# Altium schematic sheet Sheet1.SchDoc
size A; SheetNumber: 1; SheetTotal: 1
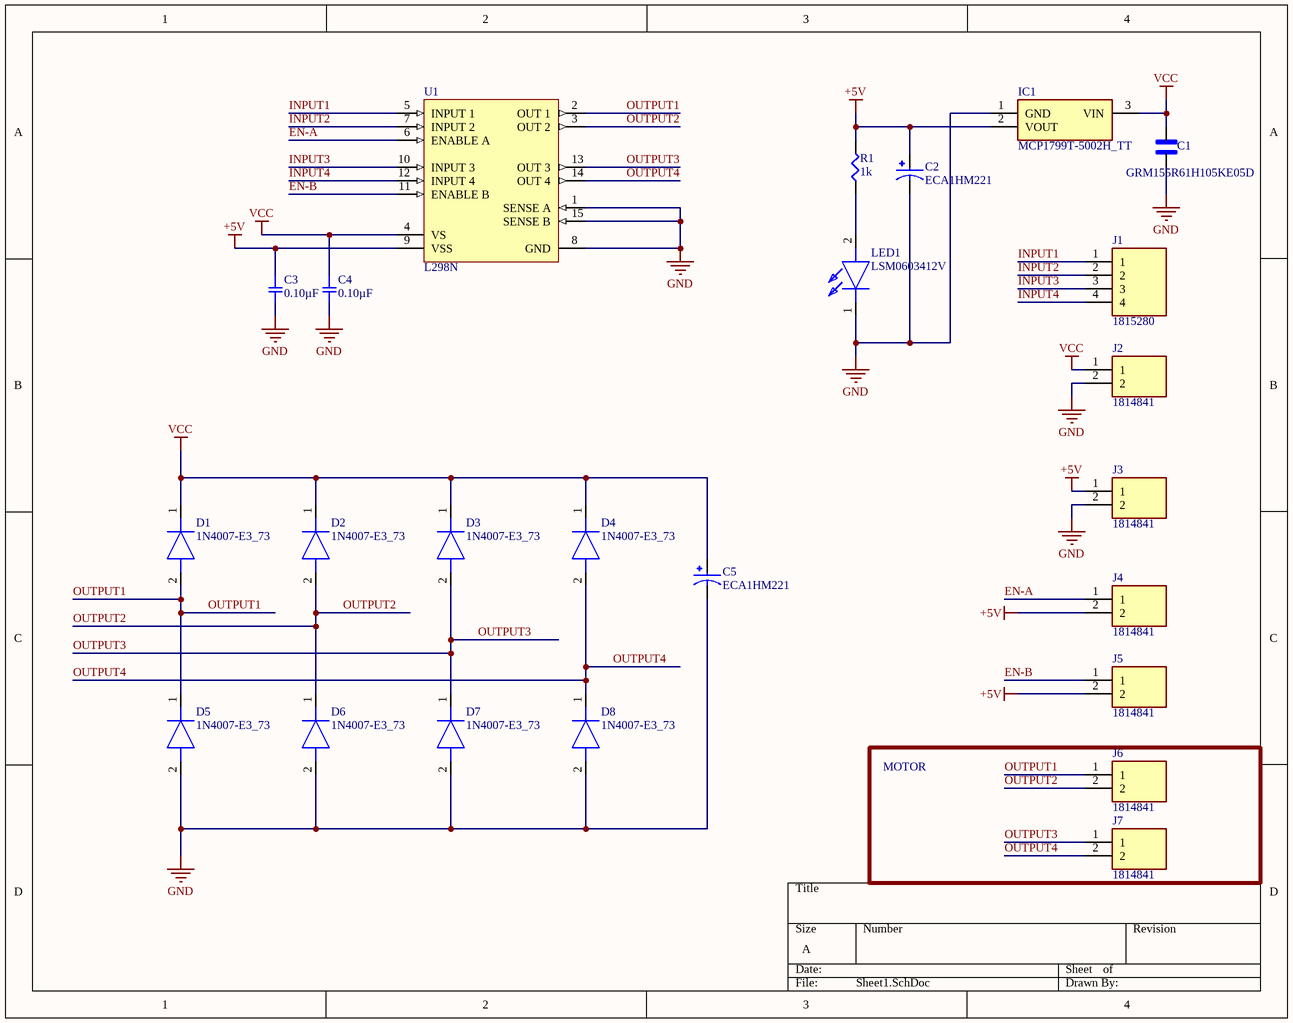
[diagram p0: Sheet1.SchDoc]

## Parts
C1  GRM155R61H105KE05D  [CAPC1005X60N]
C2  ECA1HM221  [CAPPRD500W60D1000H1250]
C3  0.10µF  [SMD-0402C]
C4  0.10µF  [SMD-0402C]
C5  ECA1HM221  [CAPPRD500W60D1000H1250]
D1  1N4007-E3_73  [PCBComponent_1]
D2  1N4007-E3_73  [PCBComponent_1]
D3  1N4007-E3_73  [PCBComponent_1]
D4  1N4007-E3_73  [PCBComponent_1]
D5  1N4007-E3_73  [PCBComponent_1]
D6  1N4007-E3_73  [PCBComponent_1]
D7  1N4007-E3_73  [PCBComponent_1]
D8  1N4007-E3_73  [PCBComponent_1]
IC1  MCP1799T-5002H_TT  [SOT95P237X112-3N]
J1  1815280  [1815280]
J2  1814841  [1814841]
J3  1814841  [1814841]
J4  1814841  [1814841]
J5  1814841  [1814841]
J6  1814841  [1814841]
J7  1814841  [1814841]
LED1  LSM0603412V  [LSM0603412V]
R1  1k  [SMD-0402-RES]
U1  L298N  [STM-FM-15]

## Blocks framed on the sheet
MOTOR: J6 J7

## Nets
+5V: C2.P C3.1 IC1.2(VOUT) J3.1 J4.2 J5.2 R1.2 U1.9(VSS)
GND: C1.1 C2.N C3.2 C4.2 C5.N D5.2(A) D6.2(A) D7.2(A) D8.2(A) IC1.1(GND) J2.2 J3.2 LED1.1(K) U1.1(SENSE_A) U1.8(GND) U1.15(SENSE_B)
VCC: C1.2 C4.1 C5.P D1.1(K) D2.1(K) D3.1(K) D4.1(K) IC1.3(VIN) J2.1 U1.4(VS)
EN-A: J4.1 U1.6(ENABLE_A)
EN-B: J5.1 U1.11(ENABLE_B)
INPUT1: J1.1 U1.5(INPUT_1)
INPUT2: J1.2 U1.7(INPUT_2)
INPUT3: J1.3 U1.10(INPUT_3)
INPUT4: J1.4 U1.12(INPUT_4)
OUTPUT1: D1.2(A) D5.1(K) J6.1 U1.2(OUT_1)
OUTPUT2: D2.2(A) D6.1(K) J6.2 U1.3(OUT_2)
OUTPUT3: D3.2(A) D7.1(K) J7.1 U1.13(OUT_3)
OUTPUT4: D4.2(A) D8.1(K) J7.2 U1.14(OUT_4)
NetLED1_2: LED1.2(A) R1.1

## Library data of the parts
C1 = GRM155R61H105KE05D: Capacitor Ceramic Multilayer (MLCC); MF: {'manufacturer': u'Murata'}; Package: None; Price: None; Value: *; MP: GRM155R61H105KE05D; Availability: Unavailable
C2 C5 = ECA1HM221: M-A; MF: {'manufacturer': u'Panasonic'}; Package: None; Price: None; Value: *; MP: ECA1HM221; Availability: Unavailable
C3 C4 = GRM155R61H104KE14D: CAP CER 0.1UF 50V X5R 0402; Manufacturer: Murata Electronics North America; Factory Stock: 0; Unit Price (USD): 0.1; Minimum Quantity: 1; Tolerance: ±10%; Datasheets: http://www.murata.com/~/media/webrenewal/support/library/catalog/products/capacitor/mlcc/c02e.pdf; Image: //media.digikey.com/Renders/Murata%20Renders/ZRB-SERIES-0402.jpg; Digi-Key Part Number: 490-10697-1-ND; Part Number: GRM155R61H104KE14D; Quantity Available: 329219; @ qty: 0; Packaging: Cut Tape (CT); Series: GRM; Part Status: Active; Value: 0.10µF; Voltage: 50V; Temperature Coefficient: X5R; Operating Temperature: -55°C ~ 85°C; Features: -; Ratings: -; Applications: General Purpose; Mounting Type: Surface Mount, MLCC; Package / Case: 0402 (1005 Metric); Size / Dimension: 0.039" L x 0.020" W (1.00mm x 0.50mm); Height - Seated (Max): -; Thickness (Max): 0.022" (0.55mm); Lead Spacing: -; Lead Style: -
D1-D8 = 1N4007-E3_73: Diode; Manufacturer_Name: Vishay; Manufacturer_Part_Number: 1N4007-E3/73; Datasheet Link: https://mouser.componentsearchengine.com/Datasheets/2/1N4007-E3_73.pdf; Mouser Part Number: 625-1N4007-E3/73; Mouser Price/Stock: https://www.mouser.co.uk/ProductDetail/Vishay-General-Semiconductor/1N4007-E3-73?qs=N4vtoAxH%2FSqT3Ng3e4K0Gw%3D%3D; Arrow Part Number: 1N4007-E3/73; Arrow Price/Stock: https://www.arrow.com/en/products/1n4007-e373/vishay?region=europe
IC1 = MCP1799T-5002H_TT: Integrated Circuit; Manufacturer_Name: Microchip; Manufacturer_Part_Number: MCP1799T-5002H/TT; Datasheet Link: https://eu.mouser.com/datasheet/2/268/MCP1799-Data-Sheet-20006248A-1658571.pdf; Height: 1.12mm; Mouser Part Number: 579-CP1799T-5002H/TT; Mouser Price/Stock: https://www.mouser.co.uk/ProductDetail/Microchip-Technology/MCP1799T-5002H-TT?qs=BJlw7L4Cy7%2Fnzou%252BAWMPCQ%3D%3D; Arrow Part Number: MCP1799T-5002H/TT; Arrow Price/Stock: https://www.arrow.com/en/products/mcp1799t-5002htt/microchip-technology?region=nac
J1 = 1815280: Connector; Manufacturer_Name: Phoenix Contact; Datasheet Link: http://www.phoenixcontact.com/de/produkte/1815280/pdf; Height: 7.65mm; Manufacturer_Part_Number: 1815280; Mouser Part Number: 651-1815280; Mouser Price/Stock: https://www.mouser.co.uk/ProductDetail/Phoenix-Contact/1815280?qs=eTPcRhULBzzcAjjk%252B9Eddw%3D%3D; Arrow Part Number: 1815280; Arrow Price/Stock: https://www.arrow.com/en/products/1815280/phoenix-contact?region=nac
J2-J7 = 1814841: Connector; Manufacturer_Name: Phoenix Contact; Datasheet Link: http://www.phoenixcontact.com/de/produkte/1814841/pdf; Height: 5.1mm; Manufacturer_Part_Number: 1814841; Mouser Part Number: 651-1814841; Mouser Price/Stock: https://www.mouser.co.uk/ProductDetail/Phoenix-Contact/1814841?qs=eTPcRhULBzwaAeA3B4lirA%3D%3D; Arrow Part Number: 1814841; Arrow Price/Stock: https://www.arrow.com/en/products/1814841/phoenix-contact?region=nac
LED1 = LSM0603412V: LED; Manufacturer_Name: Visual Communications Company; Datasheet Link: https://vcclite.com/wp-content/uploads/wpallimport/files/files/LSM0603412V.pdf; Height: 0.65mm; Manufacturer_Part_Number: LSM0603412V; Mouser Part Number: 593-LSM0603412V; Mouser Price/Stock: https://www.mouser.co.uk/ProductDetail/VCC/LSM0603412V?qs=%252BEew9%252B0nqrCIKpXilSWEhA%3D%3D; Arrow Part Number: LSM0603412V; Arrow Price/Stock: https://www.arrow.com/en/products/lsm0603412v/visual-communications?region=nac
R1 = ERJ-2GEJ102X: RES SMD 1K OHM 5% 1/10W 0402; Manufacturer: Panasonic Electronic Components; Factory Stock: 0; Unit Price (USD): 0.00350; @ qty: 1500; Minimum Quantity: 1; Power (Watts): 0.1W, 1/10W; Temperature Coefficient: ±200ppm/°C; Part Number: ERJ-2GEJ102X; Datasheets: http://industrial.panasonic.com/www-cgi/jvcr13pz.cgi?E+PZ+3+AOA0001+ERJ2GEJ102X+7+WW; Image: //media.digikey.com/Photos/Panasonic%20Photos/ERJ-PA2-Series.jpg; Digi-Key Part Number: P1.0KJCT-ND; Quantity Available: 1939857; Packaging: Cut Tape (CT); Series: ERJ; Part Status: Active; Value: 1k; Tolerance: ±5%; Composition: Thick Film; Features: Automotive AEC-Q200; Operating Temperature: -55°C ~ 155°C; Package / Case: 0402 (1005 Metric); Supplier Device Package: 0402; Size / Dimension: 0.039" L x 0.020" W (1.00mm x 0.50mm); Height - Seated (Max): 0.016" (0.40mm); Number of Terminations: 2; Failure Rate: -
U1 = CMP-2000-06526-1: Dual Full-Bridge Driver, 4.8 to 46 V, -40 to 150 degC, 15-Pin FM (MW 15L), RoHS, Tube; Manufacturer: STMicroelectronics; PartNumber: L298; Output Current: 2A; Supply Voltage Max: 7V; Driver Case Style: Multiwatt; Supply Voltage Min: 4.5V; No. of Pins: 15Pins; SVHC: NoSVHC(17-Dec-2015); Output Voltage: 46V; No. of Outputs: 4Outputs; Motor Type: FullBridge; MSL: -; Package Description: 15-Pin Flange Mount, Body 5 x 19.6 mm, Pitch 1.27 mm; Datasheet Version: 01/2000; Package Reference: FM-15; Mounting Technology: ThroughHole; Packaging: Each; Automotive Qualification Standard: -; Product Range: -; Datasheet URL: https://datasheet.ciiva.com/15109/getdatasheetpartid-50682-15109332.pdf; Operating Temperature Max: 130°C; Operating Temperature Min: -25°C; Manufacturer URL: http://www.st.com/